# Altium project VCTS_mainboard.PrjPcb (part 2 of 2)

## Sheet Panel_Interface.SchDoc
size B; SheetNumber: 6; SheetTotal: 16
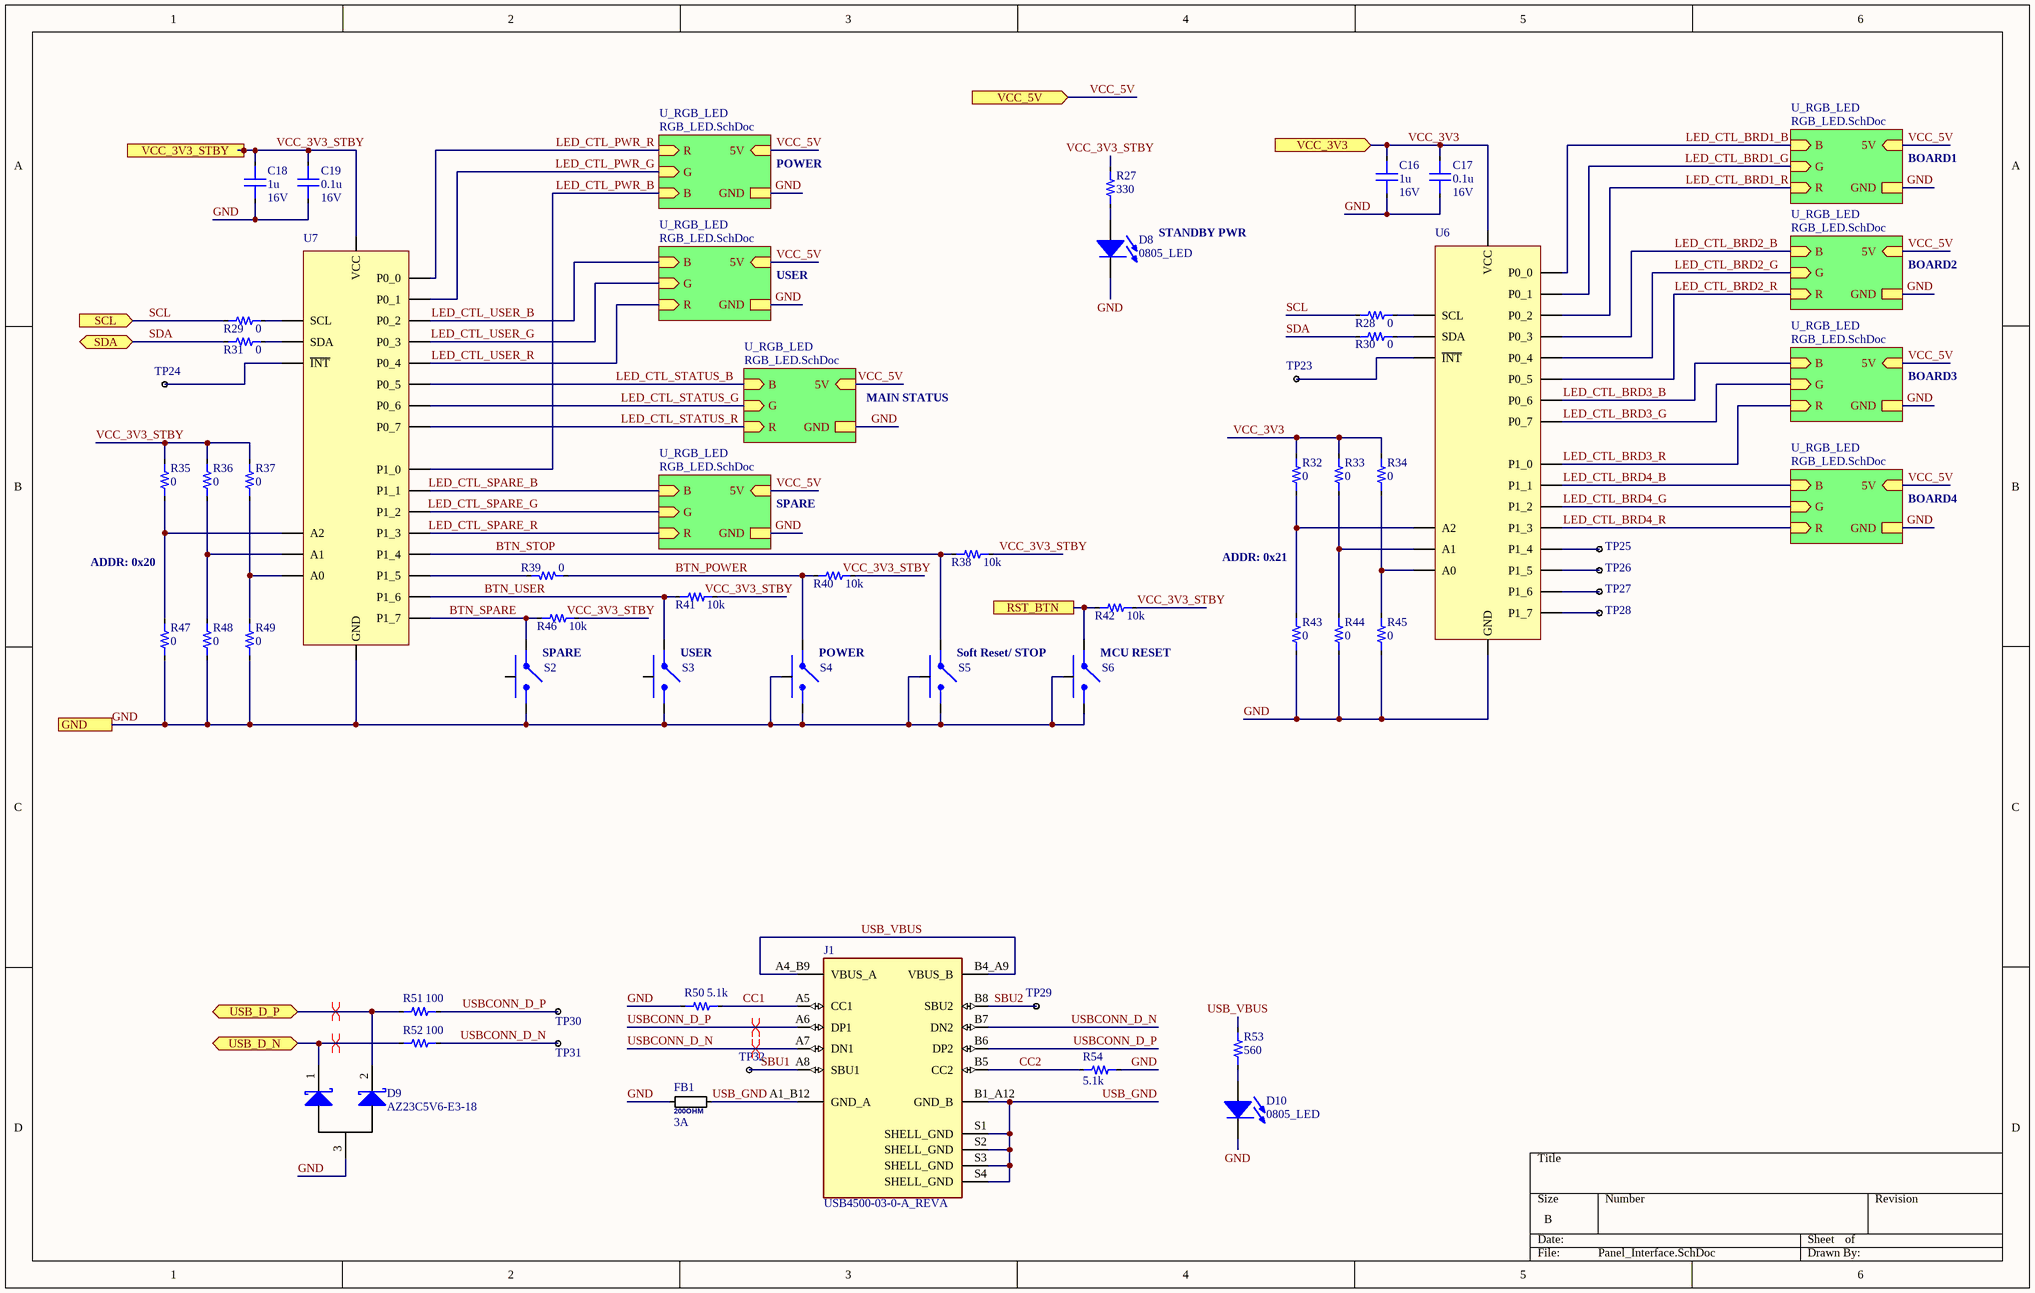
[diagram p9: Panel_Interface.SchDoc]

### Parts
C16  value 1u  Voltage: 16V  [0603_CAP]  (hidden comment: Capacitor)
C17  value 0.1u  Voltage: 16V  [0603_CAP]  (hidden comment: Capacitor)
C18  value 1u  Voltage: 16V  [0603_CAP]  (hidden comment: Capacitor)
C19  value 0.1u  Voltage: 16V  [0603_CAP]  (hidden comment: Capacitor)
D8  0805_LED  [0805_LED]
D9  AZ23C5V6-E3-18  [SOT23-3]
D10  0805_LED  [0805_LED]
FB1  =Z@100MHz: 200OHM  iMax: 3A  [0805_Ferrite]  (hidden comment: *)
J1  USB4500-03-0-A_REVA  [GCT_USB4500-03-0-A_REVA]
R27  value 330  [0603_RES]  (hidden comment: Resistor)
R28  value 0  [0603_RES]  (hidden comment: Resistor)
R29  value 0  [0603_RES]  (hidden comment: Resistor)
R30  value 0  [0603_RES]  (hidden comment: Resistor)
R31  value 0  [0603_RES]  (hidden comment: Resistor)
R32  value 0  [0603_RES]  (hidden comment: Resistor)
R33  value 0  [0603_RES]  (hidden comment: Resistor)
R34  value 0  [0603_RES]  (hidden comment: Resistor)
R35  value 0  [0603_RES]  (hidden comment: Resistor)
R36  value 0  [0603_RES]  (hidden comment: Resistor)
R37  value 0  [0603_RES]  (hidden comment: Resistor)
R38  value 10k  [0603_RES]  (hidden comment: Resistor)
R39  value 0  [0603_RES]  (hidden comment: Resistor)
R40  value 10k  [0603_RES]  (hidden comment: Resistor)
R41  value 10k  [0603_RES]  (hidden comment: Resistor)
R42  value 10k  [0603_RES]  (hidden comment: Resistor)
R43  value 0  [0603_RES]  (hidden comment: Resistor)
R44  value 0  [0603_RES]  (hidden comment: Resistor)
R45  value 0  [0603_RES]  (hidden comment: Resistor)
R46  value 10k  [0603_RES]  (hidden comment: Resistor)
R47  value 0  [0603_RES]  (hidden comment: Resistor)
R48  value 0  [0603_RES]  (hidden comment: Resistor)
R49  value 0  [0603_RES]  (hidden comment: Resistor)
R50  value 5.1k  [0603_RES]  (hidden comment: Resistor)
R51  value 100  [0603_RES]  (hidden comment: Resistor)
R52  value 100  [0603_RES]  (hidden comment: Resistor)
R53  value 560  [0603_RES]  (hidden comment: Resistor)
R54  value 5.1k  [0603_RES]  (hidden comment: Resistor)
S2  PTS645V  [PTS645V]  (value not drawn)
S3  PTS645V  [PTS645V]  (value not drawn)
S4  PTS645V  [PTS645V]  (value not drawn)
S5  PTS645V  [PTS645V]  (value not drawn)
S6  PTS645V  [PTS645V]  (value not drawn)
TP23  1mm Testpoint  [1mm_testpoint]  (value not drawn)
TP24  1mm Testpoint  [1mm_testpoint]  (value not drawn)
TP25  1mm Testpoint  [1mm_testpoint]  (value not drawn)
TP26  1mm Testpoint  [1mm_testpoint]  (value not drawn)
TP27  1mm Testpoint  [1mm_testpoint]  (value not drawn)
TP28  1mm Testpoint  [1mm_testpoint]  (value not drawn)
TP29  1mm Testpoint  [1mm_testpoint]  (value not drawn)
TP30  1mm Testpoint  [1mm_testpoint]  (value not drawn)
TP31  1mm Testpoint  [1mm_testpoint]  (value not drawn)
TP32  1mm Testpoint  [1mm_testpoint]  (value not drawn)
U6  NCA9535-Q100  [TSSOP-24. 4.4mm width]  (value not drawn)
U7  NCA9535-Q100  [TSSOP-24. 4.4mm width]  (value not drawn)

### Sub-sheets
U_RGB_LED = RGB_LED.SchDoc: 5V (in), B (in), G (in), R (in), GND
U_RGB_LED = RGB_LED.SchDoc: 5V (in), B (in), G (in), R (in), GND
U_RGB_LED = RGB_LED.SchDoc: 5V (in), B (in), G (in), R (in), GND
U_RGB_LED = RGB_LED.SchDoc: 5V (in), B (in), G (in), R (in), GND
U_RGB_LED = RGB_LED.SchDoc: 5V (in), B (in), G (in), R (in), GND
U_RGB_LED = RGB_LED.SchDoc: 5V (in), B (in), G (in), R (in), GND
U_RGB_LED = RGB_LED.SchDoc: 5V (in), B (in), G (in), R (in), GND
U_RGB_LED = RGB_LED.SchDoc: 5V (in), B (in), G (in), R (in), GND

### Ports
GND, RST_BTN, SCL (in), SDA (bidir), USB_D_N (bidir), USB_D_P (bidir), VCC_3V3 (in), VCC_3V3_STBY (in), VCC_5V (in)

### Nets
GND: C16.1 C17.1 C18.1 C19.1 D8.2(K) D9.3 D10.2(K) FB1.1 R43.1 R44.1 R45.1 R47.1 R48.1 R49.1 R50.1 R54.2 S2.2 S3.2 S4.2 S4.TAB S5.2 S5.TAB S6.2 S6.TAB U6.12(GND) U7.12(GND) ; port GND, sheet U_RGB_LED/GND, sheet U_RGB_LED/GND, sheet U_RGB_LED/GND, sheet U_RGB_LED/GND, sheet U_RGB_LED/GND, sheet U_RGB_LED/GND, sheet U_RGB_LED/GND, sheet U_RGB_LED/GND  [project net DGND]
VCC_3V3: C16.2 C17.2 R32.2 R33.2 R34.2 U6.24(VCC) ; port VCC_3V3  [project net 3V3_PWR]
VCC_3V3_STBY: C18.2 C19.2 R27.2 R35.2 R36.2 R37.2 R38.2 R40.2 R41.2 R42.2 R46.2 U7.24(VCC) ; port VCC_3V3_STBY  [project net VCC]
VCC_5V: port VCC_5V, sheet U_RGB_LED/5V, sheet U_RGB_LED/5V, sheet U_RGB_LED/5V, sheet U_RGB_LED/5V, sheet U_RGB_LED/5V, sheet U_RGB_LED/5V, sheet U_RGB_LED/5V, sheet U_RGB_LED/5V
BTN_POWER: R39.1 R40.1 S4.1
BTN_SPARE: R46.1 S2.1 U7.20(P1_7)
BTN_STOP: R38.1 S5.1 U7.17(P1_4)
BTN_USER: R41.1 S3.1 U7.19(P1_6)
CC1: J1.A5(CC1) R50.2
CC2: J1.B5(CC2) R54.1
LED_CTL_BRD1_B: U6.4(P0_0) ; sheet U_RGB_LED/B
LED_CTL_BRD1_G: U6.5(P0_1) ; sheet U_RGB_LED/G
LED_CTL_BRD1_R: U6.6(P0_2) ; sheet U_RGB_LED/R
LED_CTL_BRD2_B: U6.7(P0_3) ; sheet U_RGB_LED/B
LED_CTL_BRD2_G: U6.8(P0_4) ; sheet U_RGB_LED/G
LED_CTL_BRD2_R: U6.9(P0_5) ; sheet U_RGB_LED/R
LED_CTL_BRD3_B: U6.10(P0_6) ; sheet U_RGB_LED/B
LED_CTL_BRD3_G: U6.11(P0_7) ; sheet U_RGB_LED/G
LED_CTL_BRD3_R: U6.13(P1_0) ; sheet U_RGB_LED/R
LED_CTL_BRD4_B: U6.14(P1_1) ; sheet U_RGB_LED/B
LED_CTL_BRD4_G: U6.15(P1_2) ; sheet U_RGB_LED/G
LED_CTL_BRD4_R: U6.16(P1_3) ; sheet U_RGB_LED/R
LED_CTL_PWR_B: U7.13(P1_0) ; sheet U_RGB_LED/B
LED_CTL_PWR_G: U7.5(P0_1) ; sheet U_RGB_LED/G
LED_CTL_PWR_R: U7.4(P0_0) ; sheet U_RGB_LED/R
LED_CTL_SPARE_B: U7.14(P1_1) ; sheet U_RGB_LED/B
LED_CTL_SPARE_G: U7.15(P1_2) ; sheet U_RGB_LED/G
LED_CTL_SPARE_R: U7.16(P1_3) ; sheet U_RGB_LED/R
LED_CTL_STATUS_B: U7.9(P0_5) ; sheet U_RGB_LED/B
LED_CTL_STATUS_G: U7.10(P0_6) ; sheet U_RGB_LED/G
LED_CTL_STATUS_R: U7.11(P0_7) ; sheet U_RGB_LED/R
LED_CTL_USER_B: U7.6(P0_2) ; sheet U_RGB_LED/B
LED_CTL_USER_G: U7.7(P0_3) ; sheet U_RGB_LED/G
LED_CTL_USER_R: U7.8(P0_4) ; sheet U_RGB_LED/R
~{RST}: R42.1 S6.1 ; port RST_BTN
SBU1: J1.A8(SBU1) TP32.1
SBU2: J1.B8(SBU2) TP29.1
SCL: R28.1 R29.1 ; port SCL  [project net ONBOARD_I2C_SCL]
SDA: R30.1 R31.1 ; port SDA  [project net ONBOARD_I2C_SDA]
USB_D_N: D9.1 R52.1 ; port USB_D_N
USB_D_P: D9.2 R51.1 ; port USB_D_P
USB_GND: FB1.2 J1.A1_B12(GND_A) J1.B1_A12(GND_B) J1.S1(SHELL_GND) J1.S2(SHELL_GND) J1.S3(SHELL_GND) J1.S4(SHELL_GND)
USB_VBUS: J1.A4_B9(VBUS_A) J1.B4_A9(VBUS_B) R53.2
USBCONN_D_N: J1.A7(DN1) J1.B7(DN2) R52.2 TP31.1
USBCONN_D_P: J1.A6(DP1) J1.B6(DP2) R51.2 TP30.1
NetD8_1: D8.1(A) R27.1
NetD10_1: D10.1(A) R53.1
NetR28_2: R28.2 U6.22(SCL)
NetR29_2: R29.2 U7.22(SCL)
NetR30_2: R30.2 U6.23(SDA)
NetR31_2: R31.2 U7.23(SDA)
NetR32_1: R32.1 R43.2 U6.3(A2)
NetR33_1: R33.1 R44.2 U6.2(A1)
NetR34_1: R34.1 R45.2 U6.21(A0)
NetR35_1: R35.1 R47.2 U7.3(A2)
NetR36_1: R36.1 R48.2 U7.2(A1)
NetR37_1: R37.1 R49.2 U7.21(A0)
NetR39_2: R39.2 U7.18(P1_5)
NetTP23_1: TP23.1 U6.1(~{INT})
NetTP24_1: TP24.1 U7.1(~{INT})
NetTP25_1: TP25.1 U6.17(P1_4)
NetTP26_1: TP26.1 U6.18(P1_5)
NetTP27_1: TP27.1 U6.19(P1_6)
NetTP28_1: TP28.1 U6.20(P1_7)

Not connected (* = marked no-connect by the designer): S2 TAB; S3 TAB

### Layout directives
differential pair: USB_D_N, USB_D_P, USBCONN_D_N, USBCONN_D_P

### Notes on the sheet
- POWER
- BOARD1
- STANDBY PWR
- USER
- BOARD2
- MAIN STATUS
- BOARD3
- BOARD4
- ADDR: 0x20
- SPARE
- ADDR: 0x21
- (near S2) SPARE
- (near S3) USER
- (near S4) POWER
- Soft Reset/ STOP
- (near S6) MCU RESET

### Library data of the parts
D8 = 0805_LED: Generic 0805 LED; Color: Orange
D9 = AZ23C5V6-E3-18: Zener Diode Array 1 Pair Common Anode 5.6 V 300 mW ±7% SOT-23-3; ComponentLink1Description: Datasheet; ComponentLink1URL: https://www.vishay.com/docs/86340/az23_series.pdf; ComponentLink2Description: Digikey; ComponentLink2URL: https://www.digikey.com/en/products/detail/vishay-general-semiconductor-diodes-division/AZ23C5V6-E3-18/3104165
D10 = 0805_LED: Generic 0805 LED; Color: Green
FB1 = ChipFerrite: Link: *; MfrPartNo: *; Name: *; Resistance: *; Package: *; Inductance: *
J1 = USB4500-03-0-A_REVA: Type C USB 2.0 Connector; MF: Global Connector Technology; MP: USB4500-03-0-A; SnapEDA_Link: https://www.snapeda.com/parts/USB4500-03-0-A/Global%20Connector%20Technology/view-part/6577171/?ref=snap; Availability: No availability data; Check_prices: https://www.snapeda.com/parts/USB4500-03-0-A/Global%20Connector%20Technology/view-part/6577171/?ref=eda; Package: None; Price: None; Value: *
S2-S6 = PTS645V: Tactile Switch SPST-NO Side Actuated Surface Mount, Right Angle; Current: 0.05A; MaxVoltage: 12V; Pole: 1; Name: PTS645V; Mounting: SMD; ComponentLink1Description: Digikey; ComponentLink1URL: https://www.digikey.com/en/products/detail/c-k/PTS645SH95-2-LFS/1146763
TP23-TP32 = 1mm Testpoint: 1mm test point; ComponentLink1Description: Digikey; ComponentLink1URL: https://www.digikey.com/product-detail/en/te-connectivity-amp-connectors/RCU-0C/A106145CT-ND/3477802
U6 U7 = NCA9535-Q100: I/O Expander 16 I2C, SMBus 400 kHz 24-TSSOP; ComponentLink1Description: Digikey; ComponentLink1URL: https://www.digikey.com/en/products/detail/nexperia-usa-inc/NCA9535PW-Q100J/19109486
C16-C19 = Capacitor: Dielectric: *; Percent Tolerance: *; ESR: *
R27-R54 = Resistor: Tolerance: *

## Sheet RGB_LED.SchDoc
size A; SheetNumber: 7; SheetTotal: 16
Used 8 times, as channels U_Panel_Interface/U_RGB_LED, U_Panel_Interface/U_RGB_LED, U_Panel_Interface/U_RGB_LED, U_Panel_Interface/U_RGB_LED, U_Panel_Interface/U_RGB_LED, U_Panel_Interface/U_RGB_LED, U_Panel_Interface/U_RGB_LED, U_Panel_Interface/U_RGB_LED. Parts and nets are listed once, with the designators drawn on the sheet.
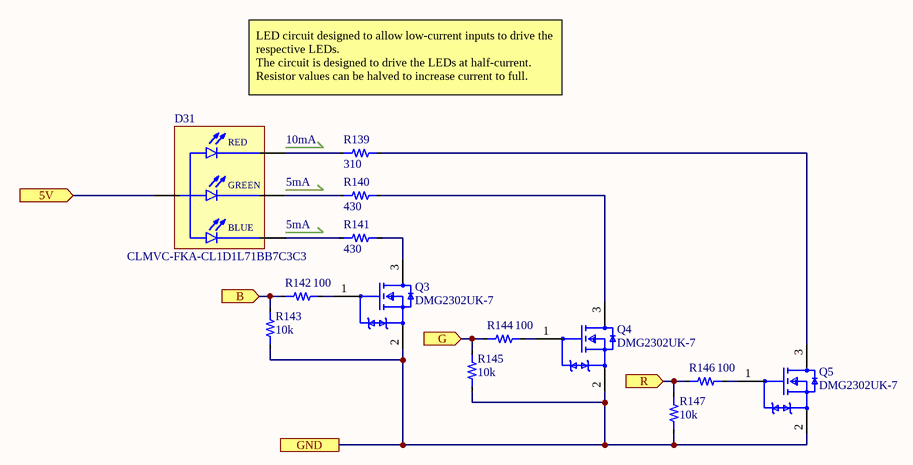
[diagram p10: RGB_LED.SchDoc]

### Parts
D31  CLMVC-FKA-CL1D1L71BB7C3C3  [4PLCC CreeLED]
Q3  DMG2302UK-7  [SOT23-3]
Q4  DMG2302UK-7  [SOT23-3]
Q5  DMG2302UK-7  [SOT23-3]
R139  value 310  [0603_RES]  (hidden comment: Resistor)
R140  value 430  [0603_RES]  (hidden comment: Resistor)
R141  value 430  [0603_RES]  (hidden comment: Resistor)
R142  value 100  [0603_RES]  (hidden comment: Resistor)
R143  value 10k  [0603_RES]  (hidden comment: Resistor)
R144  value 100  [0603_RES]  (hidden comment: Resistor)
R145  value 10k  [0603_RES]  (hidden comment: Resistor)
R146  value 100  [0603_RES]  (hidden comment: Resistor)
R147  value 10k  [0603_RES]  (hidden comment: Resistor)

### Ports
5V (in), B (in), G (in), GND, R (in)

### Nets
5V: D31.1(A) ; port 5V
B: R142.1 R143.2 ; port B
G: R144.1 R145.2 ; port G
GND: Q3.2(S) Q4.2(S) Q5.2(S) R143.1 R145.1 R147.1 ; port GND
R: R146.1 R147.2 ; port R
NetD31_2: D31.2(B_C) R141.1
NetD31_3: D31.3(G_C) R140.1
NetD31_4: D31.4(R_C) R139.1
NetQ3_1: Q3.1(G) R142.2
NetQ3_3: Q3.3(D) R141.2
NetQ4_1: Q4.1(G) R144.2
NetQ4_3: Q4.3(D) R140.2
NetQ5_1: Q5.1(G) R146.2
NetQ5_3: Q5.3(D) R139.2

### Channels
U_Panel_Interface/U_RGB_LED: designators end in _U_Panel_Interface_U_RGB_LED#1; ports 5V=VCC_5V B=LED_CTL_BRD4_B G=LED_CTL_BRD4_G GND=DGND R=LED_CTL_BRD4_R
U_Panel_Interface/U_RGB_LED: designators end in _U_Panel_Interface_U_RGB_LED#2; ports 5V=VCC_5V B=LED_CTL_BRD3_B G=LED_CTL_BRD3_G GND=DGND R=LED_CTL_BRD3_R
U_Panel_Interface/U_RGB_LED: designators end in _U_Panel_Interface_U_RGB_LED#3; ports 5V=VCC_5V B=LED_CTL_BRD2_B G=LED_CTL_BRD2_G GND=DGND R=LED_CTL_BRD2_R
U_Panel_Interface/U_RGB_LED: designators end in _U_Panel_Interface_U_RGB_LED#4; ports 5V=VCC_5V B=LED_CTL_BRD1_B G=LED_CTL_BRD1_G GND=DGND R=LED_CTL_BRD1_R
U_Panel_Interface/U_RGB_LED: designators end in _U_Panel_Interface_U_RGB_LED#5; ports 5V=VCC_5V B=LED_CTL_PWR_B G=LED_CTL_PWR_G GND=DGND R=LED_CTL_PWR_R
U_Panel_Interface/U_RGB_LED: designators end in _U_Panel_Interface_U_RGB_LED#6; ports 5V=VCC_5V B=LED_CTL_STATUS_B G=LED_CTL_STATUS_G GND=DGND R=LED_CTL_STATUS_R
U_Panel_Interface/U_RGB_LED: designators end in _U_Panel_Interface_U_RGB_LED#7; ports 5V=VCC_5V B=LED_CTL_USER_B G=LED_CTL_USER_G GND=DGND R=LED_CTL_USER_R
U_Panel_Interface/U_RGB_LED: designators end in _U_Panel_Interface_U_RGB_LED#8; ports 5V=VCC_5V B=LED_CTL_SPARE_B G=LED_CTL_SPARE_G GND=DGND R=LED_CTL_SPARE_R

### Notes on the sheet
- LED circuit designed to allow low-current inputs to drive the respective LEDs.
  The circuit is designed to drive the LEDs at half-current.
  Resistor values can be halved to increase current to full.
- 10mA
- 5mA
- (in symbol CLMVC-FKA-CL1D1L71BB7C3C3) RED; GREEN; BLUE

### Library data of the parts
D31 = CLMVC-FKA-CL1D1L71BB7C3C3: Red, Green, Blue (RGB) 622nm Red, 530nm Green, 470nm Blue LED Indication - Discrete 2V Red, 3V Green, 3V Blue 4-SMD, J-Lead; MF: Cree Inc.; SnapEDA_Link: https://www.snapeda.com/parts/CLMVC-FKA-CL1D1L71BB7C3C3/Cree+Inc./view-part/?ref=snap; Package: SMD-4 Cree Inc.; Value: *; MP: CLMVC-FKA-CL1D1L71BB7C3C3; Check_prices: https://www.snapeda.com/parts/CLMVC-FKA-CL1D1L71BB7C3C3/Cree+Inc./view-part/?ref=eda
Q3-Q5 = DMG2302UK-7: MOSFET N-CH 20V 2.8A SOT23; Manufacturer: Diodes Inc.; Reverse Recovery Time: 5.3ns; Gate Charge At Vgs: 2.8nC @ 10V; Turn On Delay Time: 0.6ns; Pulse Drain Current: 12A; Max Forward Diode Voltage: 1.2V; Reverse Recovery Charge: 0.5nC; Automotive Grade: Grade 0; Threshold Vgs Min: 0.3V; Number Of N Channels: 1; Standoff Height: 0.013mm; Typ Forward Diode Voltage: 0.7V; Drain To Source Resistance: 61mΩ; Rthja Max: 192°C/W; Max Junction Temp: +150°C; Input Capacitace At Vds: 130pF @ 10V; Threshold Vgs Max: 1V; Turn Off Delay Time: 4.2ns; Depletion Mode: False; Gate To Source Voltage: 12V; Power Dissipation: 0.66W; Device Class L1: Discrete Semiconductors; Footprint Url: https://www.diodes.com/assets/Package-Files/SOT23.pdf; Lead Free: Yes; Manufacturer Part Number: DMG2302UK-7; Temperature Range High: +150°C; Drain To Source Voltage: 20V; Category: Trans; Digikey Description: MOSFET N-CH 20V 2.8A SOT23; RoHS: TRUE; Device Class L2: Transistors; Height: 1.1mm; Automotive: Yes; Package: SOT23; Drain To Source Breakdown Voltage: 20V; Continuous Drain Current: 2.8A; ComponentLink2Description: Datasheet; Device Class L3: MOSFETs; Octopart: https://octopart.com/dmg2302uk-7-diodes+inc.-73850182; Temperature Range Low: -55°C; Temperature: -55°C to +150°C; Number Of Channels: 1; ComponentLink2URL: https://www.diodes.com/assets/Datasheets/DMG2302UK.pdf
R139-R147 = Resistor: Tolerance: *

## Sheet FAN_Conn.SchDoc
size A; SheetNumber: 8; SheetTotal: 16
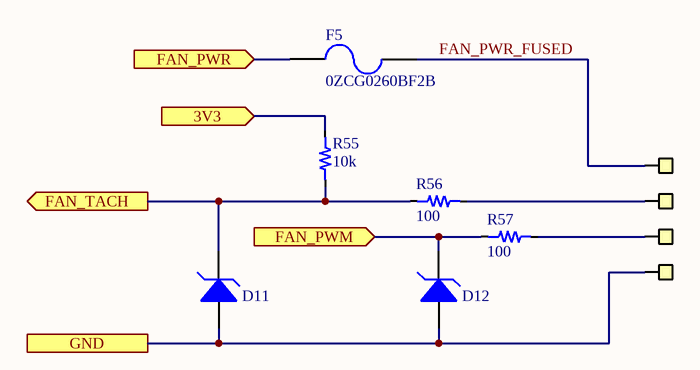
[diagram p11: FAN_Conn.SchDoc]

### Parts
D11  SZMMSZ5227BT1G  [SOD-123]  (value not drawn)
D12  SZMMSZ5227BT1G  [SOD-123]  (value not drawn)
F5  0ZCG0260BF2B  [1812_PTC_FUSE]
R55  value 10k  [0603_RES]  (hidden comment: Resistor)
R56  value 100  [0603_RES]  (hidden comment: Resistor)
R57  value 100  [0603_RES]  (hidden comment: Resistor)
X6  GenericPinHeader(0.1in)  [GenericPinHeader(.1in)]  (value not drawn)
X7  GenericPinHeader(0.1in)  [GenericPinHeader(.1in)]  (value not drawn)
X8  GenericPinHeader(0.1in)  [GenericPinHeader(.1in)]  (value not drawn)
X9  GenericPinHeader(0.1in)  [GenericPinHeader(.1in)]  (value not drawn)

### Ports
3V3 (in), FAN_PWM (in), FAN_PWR (in), FAN_TACH (out), GND

### Nets
3V3_PWR: R55.2 ; port 3V3
12V_PWR: F5.1 ; port FAN_PWR
DGND: D11.2(A) D12.2(A) X9.1(Pin) ; port GND
FAN_PWM: D12.1(K) R57.2 ; port FAN_PWM
FAN_PWR_FUSED: F5.2 X6.1(Pin)
FAN_TACH: D11.1(K) R55.1 R56.2 ; port FAN_TACH
NetR56_1: R56.1 X7.1(Pin)
NetR57_1: R57.1 X8.1(Pin)

### Library data of the parts
D11 D12 = SZMMSZ5227BT1G: Zener Diode 3.6 V 500 mW ±5% Surface Mount SOD-123; Vr: 3.6; Num_Circuits: 1; Package: SOD-123; ComponentLink1Description: Digikey; ComponentLink1URL: https://www.digikey.com/en/products/detail/onsemi/SZMMSZ5227BT1G/3063346
F5 = PTC Fuse: Generic PTC fuse footprints. Add; Current - Hold (Ih): 2.6A; Current - Trip (It): 5A; Voltage - Max: *; Resistance - Initial (Ri) (Min): *; Resistance - Post Trip (R1) (Max): *
X6-X9 = GenericPinHeader(0.1in): Generic .1in(2.54mm) pitch pin header
R55-R57 = Resistor: Tolerance: *

## Sheet Interface_Load_Switching.SchDoc
size B; SheetNumber: 14; SheetTotal: 16
Used 2 times, as channels U_Interface_Load_Switching, U_Interface_Load_Switching. Parts and nets are listed once, with the designators drawn on the sheet.
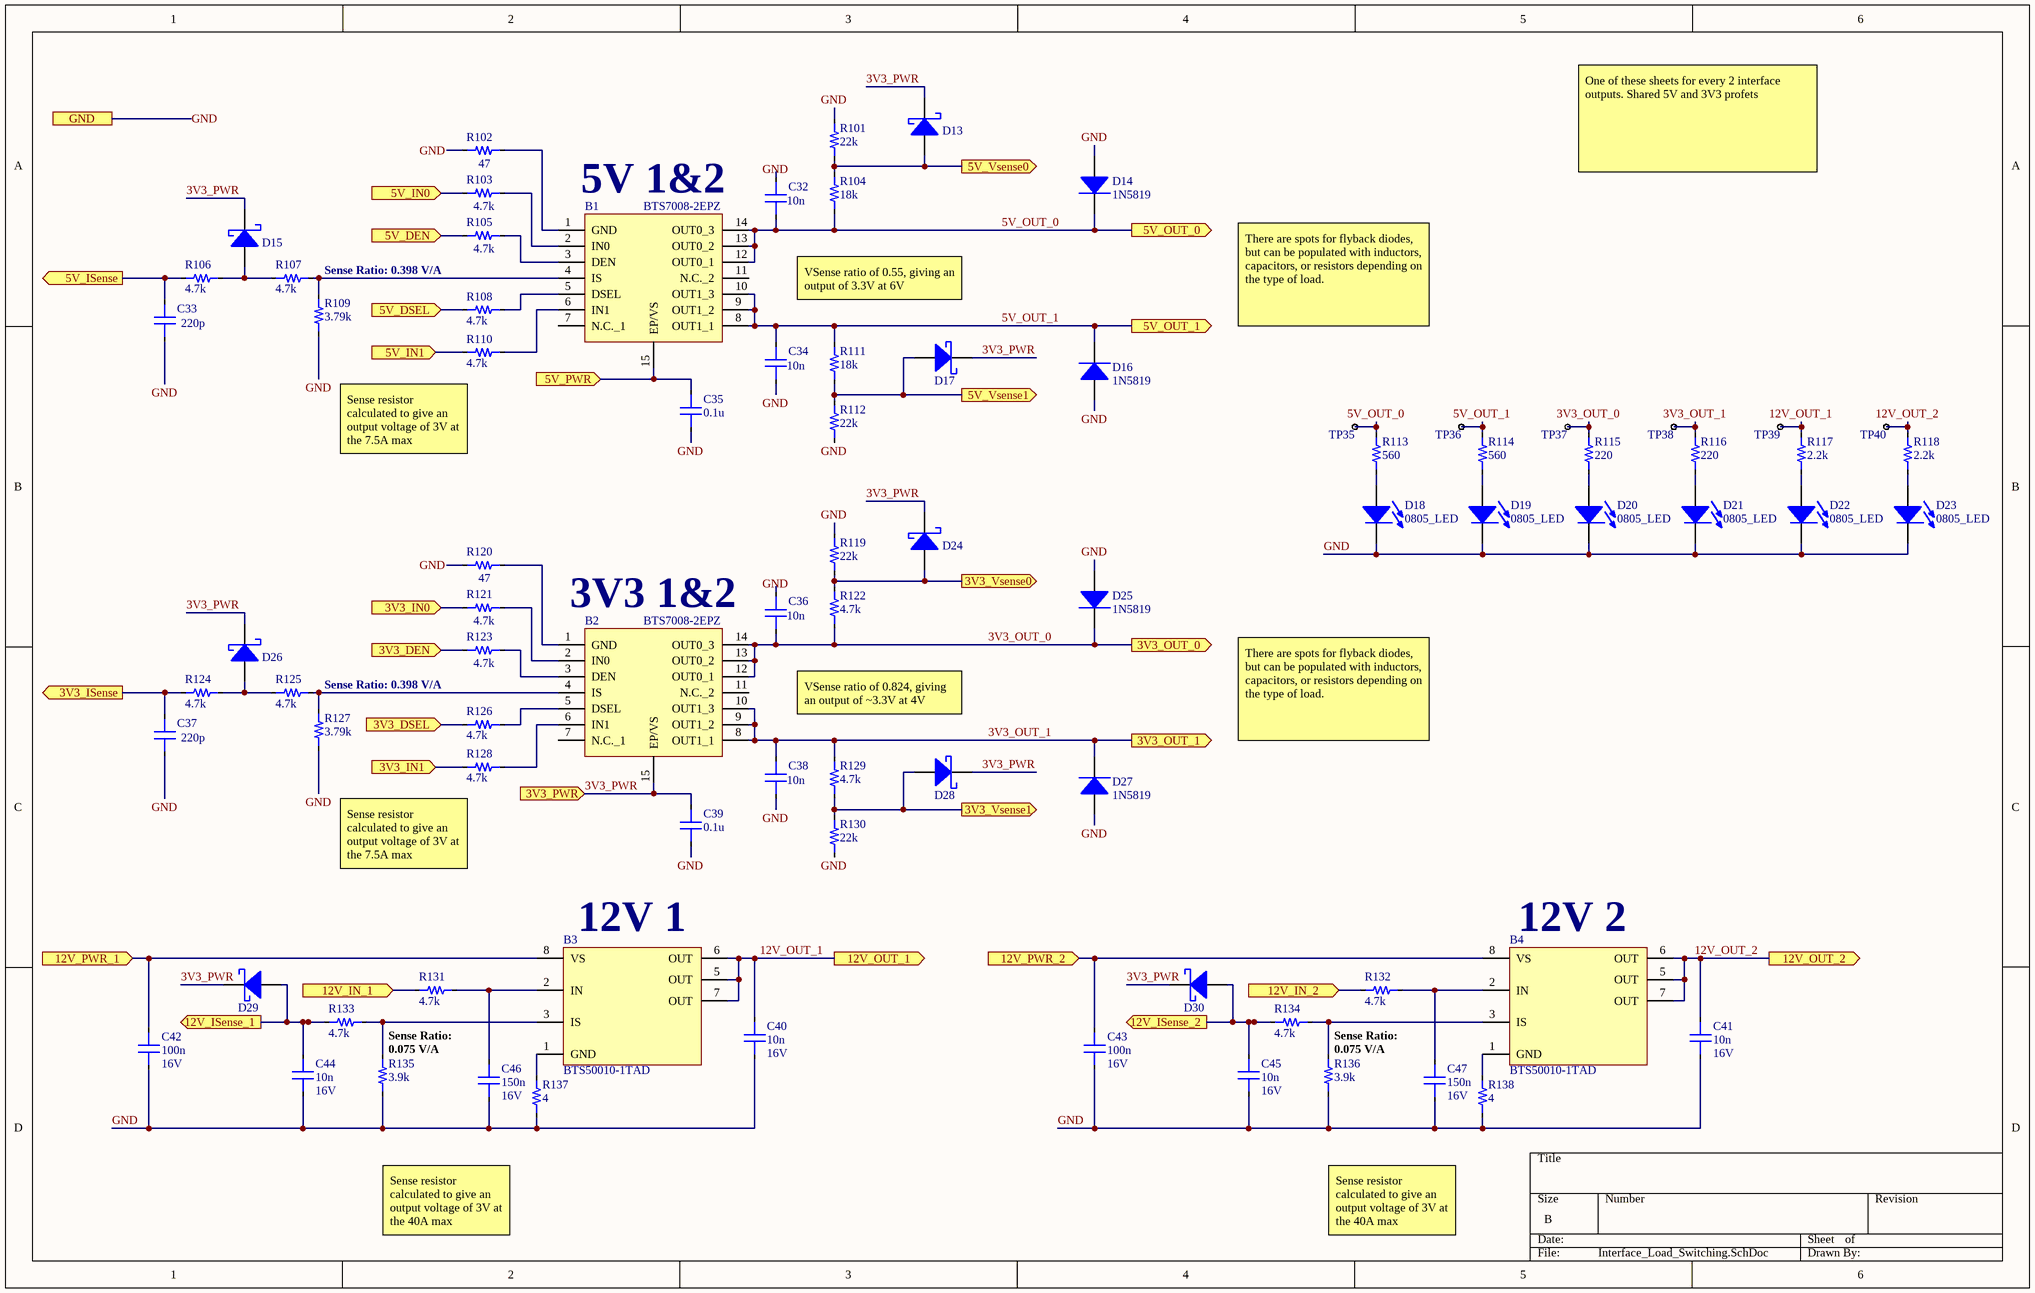
[diagram p12: Interface_Load_Switching.SchDoc]

### Parts
B1  BTS7008-2EPZ  [SOP65P600X115-15N]
B2  BTS7008-2EPZ  [SOP65P600X115-15N]
B3  BTS50010-1TAD  [TO-263-7]
B4  BTS50010-1TAD  [TO-263-7]
C32  value 10n  [0603_CAP]  (hidden comment: Capacitor)
C33  value 220p  [0603_CAP]  (hidden comment: Capacitor)
C34  value 10n  [0603_CAP]  (hidden comment: Capacitor)
C35  value 0.1u  [0603_CAP]  (hidden comment: Capacitor)
C36  value 10n  [0603_CAP]  (hidden comment: Capacitor)
C37  value 220p  [0603_CAP]  (hidden comment: Capacitor)
C38  value 10n  [0603_CAP]  (hidden comment: Capacitor)
C39  value 0.1u  [0603_CAP]  (hidden comment: Capacitor)
C40  value 10n  Voltage: 16V  [0603_CAP]  (hidden comment: Capacitor)
C41  value 10n  Voltage: 16V  [0603_CAP]  (hidden comment: Capacitor)
C42  value 100n  Voltage: 16V  [0603_CAP]  (hidden comment: Capacitor)
C43  value 100n  Voltage: 16V  [0603_CAP]  (hidden comment: Capacitor)
C44  value 10n  Voltage: 16V  [0603_CAP]  (hidden comment: Capacitor)
C45  value 10n  Voltage: 16V  [0603_CAP]  (hidden comment: Capacitor)
C46  value 150n  Voltage: 16V  [0603_CAP]  (hidden comment: Capacitor)
C47  value 150n  Voltage: 16V  [0603_CAP]  (hidden comment: Capacitor)
D13  RBR2MM30BTFTR  [SOD-123F]  (value not drawn)
D14  1N5819  [SOD-123F]
D15  RBR2MM30BTFTR  [SOD-123F]  (value not drawn)
D16  1N5819  [SOD-123F]
D17  RBR2MM30BTFTR  [SOD-123F]  (value not drawn)
D18  0805_LED  [0805_LED]
D19  0805_LED  [0805_LED]
D20  0805_LED  [0805_LED]
D21  0805_LED  [0805_LED]
D22  0805_LED  [0805_LED]
D23  0805_LED  [0805_LED]
D24  RBR2MM30BTFTR  [SOD-123F]  (value not drawn)
D25  1N5819  [SOD-123F]
D26  RBR2MM30BTFTR  [SOD-123F]  (value not drawn)
D27  1N5819  [SOD-123F]
D28  RBR2MM30BTFTR  [SOD-123F]  (value not drawn)
D29  RBR2MM30BTFTR  [SOD-123F]  (value not drawn)
D30  RBR2MM30BTFTR  [SOD-123F]  (value not drawn)
R101  value 22k  [0603_RES]  (hidden comment: Resistor)
R102  value 47  [0603_RES]  (hidden comment: Resistor)
R103  value 4.7k  [0603_RES]  (hidden comment: R(IN))
R104  value 18k  [0603_RES]  (hidden comment: Resistor)
R105  value 4.7k  [0603_RES]  (hidden comment: Resistor)
R106  value 4.7k  [0603_RES]  (hidden comment: Resistor)
R107  value 4.7k  [0603_RES]  (hidden comment: Resistor)
R108  value 4.7k  [0603_RES]  (hidden comment: Resistor)
R109  value 3.79k  [0603_RES]  (hidden comment: Resistor)
R110  value 4.7k  [0603_RES]  (hidden comment: Resistor)
R111  value 18k  [0603_RES]  (hidden comment: Resistor)
R112  value 22k  [0603_RES]  (hidden comment: Resistor)
R113  value 560  [0603_RES]  (hidden comment: Resistor)
R114  value 560  [0603_RES]  (hidden comment: Resistor)
R115  value 220  [0603_RES]  (hidden comment: Resistor)
R116  value 220  [0603_RES]  (hidden comment: Resistor)
R117  value 2.2k  [0603_RES]  (hidden comment: Resistor)
R118  value 2.2k  [0603_RES]  (hidden comment: Resistor)
R119  value 22k  [0603_RES]  (hidden comment: Resistor)
R120  value 47  [0603_RES]  (hidden comment: Resistor)
R121  value 4.7k  [0603_RES]  (hidden comment: R(IN))
R122  value 4.7k  [0603_RES]  (hidden comment: Resistor)
R123  value 4.7k  [0603_RES]  (hidden comment: Resistor)
R124  value 4.7k  [0603_RES]  (hidden comment: Resistor)
R125  value 4.7k  [0603_RES]  (hidden comment: Resistor)
R126  value 4.7k  [0603_RES]  (hidden comment: Resistor)
R127  value 3.79k  [0603_RES]  (hidden comment: Resistor)
R128  value 4.7k  [0603_RES]  (hidden comment: Resistor)
R129  value 4.7k  [0603_RES]  (hidden comment: Resistor)
R130  value 22k  [0603_RES]  (hidden comment: Resistor)
R131  value 4.7k  [0603_RES]  (hidden comment: Resistor)
R132  value 4.7k  [0603_RES]  (hidden comment: Resistor)
R133  value 4.7k  [0603_RES]  (hidden comment: Resistor)
R134  value 4.7k  [0603_RES]  (hidden comment: Resistor)
R135  value 3.9k  [0603_RES]  (hidden comment: Resistor)
R136  value 3.9k  [0603_RES]  (hidden comment: Resistor)
R137  value 4  [0805_RES]  (hidden comment: Resistor)
R138  value 4  [0805_RES]  (hidden comment: Resistor)
TP35  1mm Testpoint  [1mm_testpoint]  (value not drawn)
TP36  1mm Testpoint  [1mm_testpoint]  (value not drawn)
TP37  1mm Testpoint  [1mm_testpoint]  (value not drawn)
TP38  1mm Testpoint  [1mm_testpoint]  (value not drawn)
TP39  1mm Testpoint  [1mm_testpoint]  (value not drawn)
TP40  1mm Testpoint  [1mm_testpoint]  (value not drawn)

### Ports
3V3_DEN (in), 3V3_DSEL (in), 3V3_IN0 (in), 3V3_IN1 (in), 3V3_ISense (out), 3V3_OUT_0 (out), 3V3_OUT_1 (out), 3V3_PWR (in), 3V3_Vsense0 (out), 3V3_Vsense1 (out), 5V_DEN (in), 5V_DSEL (in), 5V_IN0 (in), 5V_IN1 (in), 5V_ISense (out), 5V_OUT_0 (out), 5V_OUT_1 (out), 5V_PWR (in), 5V_Vsense0 (out), 5V_Vsense1 (out), 12V_IN_1 (in), 12V_IN_2 (in), 12V_ISense_1 (out), 12V_ISense_2 (out), 12V_OUT_1 (out), 12V_OUT_2 (out), 12V_PWR_1 (in), 12V_PWR_2 (in), GND

### Nets
3V3_DEN: R123.2 ; port 3V3_DEN
3V3_DSEL: R126.1 ; port 3V3_DSEL
3V3_IN0: R121.2 ; port 3V3_IN0
3V3_IN1: R128.2 ; port 3V3_IN1
3V3_ISense: C37.2 R124.1 ; port 3V3_ISense
3V3_OUT_0: B2.12(OUT0_1) B2.13(OUT0_2) B2.14(OUT0_3) C36.1 D25.1 R115.2 R122.1 TP37.1 ; port 3V3_OUT_0
3V3_OUT_1: B2.8(OUT1_1) B2.9(OUT1_2) B2.10(OUT1_3) C38.2 D27.1 R116.2 R129.1 TP38.1 ; port 3V3_OUT_1
3V3_PWR: B2.15(EP/VS) C39.2 D13.1(K) D15.1(K) D17.1(K) D24.1(K) D26.1(K) D28.1(K) D29.1(K) D30.1(K) ; port 3V3_PWR
3V3_Vsense0: D24.2(A) R119.1 R122.2 ; port 3V3_Vsense0
3V3_Vsense1: D28.2(A) R129.2 R130.1 ; port 3V3_Vsense1
5V_DEN: R105.2 ; port 5V_DEN
5V_DSEL: R108.1 ; port 5V_DSEL
5V_IN0: R103.2 ; port 5V_IN0
5V_IN1: R110.2 ; port 5V_IN1
5V_ISense: C33.2 R106.1 ; port 5V_ISense
5V_OUT_0: B1.12(OUT0_1) B1.13(OUT0_2) B1.14(OUT0_3) C32.1 D14.1 R104.1 R113.2 TP35.1 ; port 5V_OUT_0
5V_OUT_1: B1.8(OUT1_1) B1.9(OUT1_2) B1.10(OUT1_3) C34.2 D16.1 R111.1 R114.2 TP36.1 ; port 5V_OUT_1
5V_PWR: B1.15(EP/VS) C35.2 ; port 5V_PWR
5V_Vsense0: D13.2(A) R101.1 R104.2 ; port 5V_Vsense0
5V_Vsense1: D17.2(A) R111.2 R112.1 ; port 5V_Vsense1
12V_IN_1: R131.1 ; port 12V_IN_1
12V_IN_2: R132.1 ; port 12V_IN_2
12V_ISense_1: C44.2 D29.2(A) R133.1 ; port 12V_ISense_1
12V_ISense_2: C45.2 D30.2(A) R134.1 ; port 12V_ISense_2
12V_OUT_1: B3.5(OUT) B3.6(OUT) B3.7(OUT) C40.2 R117.2 TP39.1 ; port 12V_OUT_1
12V_OUT_2: B4.5(OUT) B4.6(OUT) B4.7(OUT) C41.2 R118.2 TP40.1 ; port 12V_OUT_2
12V_PWR_1: B3.8(VS) C42.2 ; port 12V_PWR_1
12V_PWR_2: B4.8(VS) C43.2 ; port 12V_PWR_2
GND: C32.2 C33.1 C34.1 C35.1 C36.2 C37.1 C38.1 C39.1 C40.1 C41.1 C42.1 C43.1 C44.1 C45.1 C46.1 C47.1 D14.2 D16.2 D18.2(K) D19.2(K) D20.2(K) D21.2(K) D22.2(K) D23.2(K) D25.2 D27.2 R101.2 R102.2 R109.1 R112.2 R119.2 R120.2 R127.1 R130.2 R135.1 R136.1 R137.1 R138.1 ; port GND
NetB1_1: B1.1(GND) R102.1
NetB1_2: B1.2(IN0) R103.1
NetB1_3: B1.3(DEN) R105.1
NetB1_4: B1.4(IS) R107.2 R109.2
NetB1_5: B1.5(DSEL) R108.2
NetB1_6: B1.6(IN1) R110.1
NetB2_1: B2.1(GND) R120.1
NetB2_2: B2.2(IN0) R121.1
NetB2_3: B2.3(DEN) R123.1
NetB2_4: B2.4(IS) R125.2 R127.2
NetB2_5: B2.5(DSEL) R126.2
NetB2_6: B2.6(IN1) R128.1
NetB3_1: B3.1(GND) R137.2
NetB3_2: B3.2(IN) C46.2 R131.2
NetB3_3: B3.3(IS) R133.2 R135.2
NetB4_1: B4.1(GND) R138.2
NetB4_2: B4.2(IN) C47.2 R132.2
NetB4_3: B4.3(IS) R134.2 R136.2
NetD15_2: D15.2(A) R106.2 R107.1
NetD18_1: D18.1(A) R113.1
NetD19_1: D19.1(A) R114.1
NetD20_1: D20.1(A) R115.1
NetD21_1: D21.1(A) R116.1
NetD22_1: D22.1(A) R117.1
NetD23_1: D23.1(A) R118.1
NetD26_2: D26.2(A) R124.2 R125.1

Not connected (* = marked no-connect by the designer): B1 7(N.C._1) 11(N.C._2); B2 7(N.C._1) 11(N.C._2)

### Channels
U_Interface_Load_Switching: designators end in _U_Interface_Load_Switching#1; ports 3V3_DEN=PWR_D_EN 3V3_DSEL=PWR_D_SEL 3V3_IN0=12V_IN_1 3V3_IN1=12V_IN_2 3V3_ISense=3V3_ISense 3V3_OUT_0=3V3_OUT_0 3V3_OUT_1=3V3_OUT_1 3V3_PWR=3V3_PWR 3V3_Vsense0=3V3_Vsense0 3V3_Vsense1=3V3_Vsense1 5V_DEN=PWR_D_EN 5V_DSEL=PWR_D_SEL 5V_IN0=12V_IN_1 5V_IN1=12V_IN_2 5V_ISense=5V_ISense 5V_OUT_0=5V_OUT_0 5V_OUT_1=5V_OUT_1 5V_PWR=VCC_5V 5V_Vsense0=5V_Vsense0 5V_Vsense1=5V_Vsense1 12V_IN_1=12V_IN_1 12V_IN_2=12V_IN_2 12V_ISense_1=12V_ISense_1 12V_ISense_2=12V_ISense_2 12V_OUT_1=12V_OUT_1 12V_OUT_2=12V_OUT_2 12V_PWR_1=12V_PWR 12V_PWR_2=12V_PWR GND=DGND
U_Interface_Load_Switching: designators end in _U_Interface_Load_Switching#2; ports 3V3_DEN=PWR_D_EN 3V3_DSEL=PWR_D_SEL 3V3_IN0=12V_IN_1 3V3_IN1=12V_IN_2 3V3_ISense=3V3_ISense 3V3_OUT_0=3V3_OUT_0 3V3_OUT_1=3V3_OUT_1 3V3_PWR=3V3_PWR 3V3_Vsense0=3V3_Vsense0 3V3_Vsense1=3V3_Vsense1 5V_DEN=PWR_D_EN 5V_DSEL=PWR_D_SEL 5V_IN0=12V_IN_1 5V_IN1=12V_IN_2 5V_ISense=5V_ISense 5V_OUT_0=5V_OUT_0 5V_OUT_1=5V_OUT_1 5V_PWR=VCC_5V 5V_Vsense0=5V_Vsense0 5V_Vsense1=5V_Vsense1 12V_IN_1=12V_IN_1 12V_IN_2=12V_IN_2 12V_ISense_1=12V_ISense_1 12V_ISense_2=12V_ISense_2 12V_OUT_1=12V_OUT_1 12V_OUT_2=12V_OUT_2 12V_PWR_1=12V_PWR 12V_PWR_2=12V_PWR GND=DGND

### Notes on the sheet
- One of these sheets for every 2 interface outputs. Shared 5V and 3V3 profets
- (near B1) 5V 1&2
- Sense Ratio: 0.398 V/A
- VSense ratio of 0.55, giving an output of 3.3V at 6V
- There are spots for flyback diodes, but can be populated with inductors, capacitors, or resistors depending on the type of load.
- (near R110) Sense resistor calculated to give an output voltage of 3V at the 7.5A max
- (near B2) 3V3 1&2
- VSense ratio of 0.824, giving an output of ~3.3V at 4V
- (near R128) Sense resistor calculated to give an output voltage of 3V at the 7.5A max
- (near B3) 12V 1
- (near B4) 12V 2
- (near R135) Sense Ratio:
  0.075 V/A
- (near R136) Sense Ratio:
  0.075 V/A
- Sense resistor calculated to give an output voltage of 3V at the 40A max

### Library data of the parts
B1 B2 = BTS7008-2EPZ: PROFET +2 12V Smart High-Side Power Switch; Manufacturer_Name: Infineon; Geometry.Height: 1.15mm; Manufacturer_Part_Number: BTS7008-2EPZ; Mouser Part Number: *; Mouser Price/Stock: *; Arrow Part Number: *; Arrow Price/Stock: *; Mouser Testing Part Number: *; Mouser Testing Price/Stock: *; Datasheet Link: https://4donline.ihs.com/images/VipMasterIC/IC/INFN/INFN-S-A0012431809/INFN-S-A0012432886-1.pdf?hkey=EF798316E3902B6ED9A73243A3159BB0; Supplier 1: Mouser; Supplier Part Number 1: 726-BTS70082EPZXUMA1
B3 B4 = BTS50010-1TAD: Power Switch/Driver 1:1 N-Channel 48A P/PG-TO-263-7-10; ComponentLink1Description: Digikey; ComponentLink1URL: https://www.digikey.com/en/products/detail/infineon-technologies/BTS500101TADATMA2/9693060; ComponentLink2Description: Datasheet; ComponentLink2URL: https://www.infineon.com/dgdl/Infineon-BTS50010-1TAD-DS-v01_01-EN.pdf?fileId=5546d462576f34750157c38810ca55cd
C32 C34 C36 C38 = Capacitor: Protection of BTS7008-2EPZ output during ESD events and BCI; Voltage: 16V; Dielectric: *; Percent Tolerance: *; ESR: *
C33 C37 = Capacitor: Sense signal filtering; Voltage: 16V; Dielectric: *; Percent Tolerance: *; ESR: *
D13 D15 D17 D24 D26 D28-D30 = RBR2MM30BTFTR: Diode Schottky 30 V 2A Surface Mount SOD-123F; Vr: 30; Num_Circuits: 1; Vf: 490 mV @ 2 A; Package: SOD-123F; ComponentLink1Description: Digikey; ComponentLink1URL: https://www.digikey.com/en/products/detail/rohm-semiconductor/RBR2MM30BTFTR/9748137
D14 D16 D25 D27 = 1N5819: Diode Super Barrier 40V 1A Surface Mount SOD-123F; Num_Circuits: 1; Vr: 40V; Package: SOD-123F; ComponentLink1Description: Digikey; ComponentLink1URL: https://www.digikey.com/product-detail/en/diodes-incorporated/1N5819HW1-7-F/1N5819HW1-7-FDITR-ND/5768523
D18-D23 = 0805_LED: Generic 0805 LED; Color: Green
R101 R104 R119 R122 R135 R136 = Resistor: Tolerance: 1%
R103 R105 R110 R121 R123 R128 = Resistor: Protection of the microcontroller during Overvoltage and Reverse Polarity / Necessary to switch OFF BTS7008-2EPZ output during Loss of Ground; Tolerance: *
R106 R124 = Resistor: Protection of microcontroller ADC input during Overvoltage, Reverse / Polarity, Loss of Ground / Value to be tuned according to microcontroller specifications; Tolerance: *
R109 R127 = Resistor: SENSE resistor; Tolerance: 1%
R111 R112 R129 R130 = Resistor: Protection of the microcontroller during Overvoltage and Reverse Polarity / Necessary to switch OFF BTS7008-2EPZ output during Loss of Ground; Tolerance: 1%
TP35-TP40 = 1mm Testpoint: 1mm test point; ComponentLink1Description: Digikey; ComponentLink1URL: https://www.digikey.com/product-detail/en/te-connectivity-amp-connectors/RCU-0C/A106145CT-ND/3477802
C35 C39-C47 = Capacitor: Dielectric: *; Percent Tolerance: *; ESR: *
R102 R107 R108 R113-R118 R120 R125 R126 R131-R134 R137 R138 = Resistor: Tolerance: *

## Sheet 3V3_LDO.SchDoc
size A; SheetNumber: 15; SheetTotal: 16
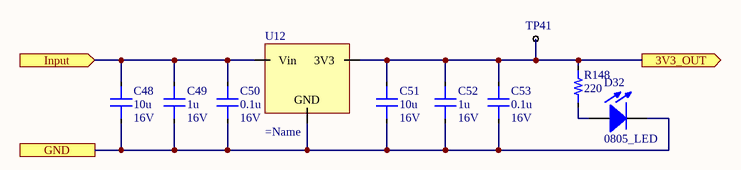
[diagram p13: 3V3_LDO.SchDoc]

### Parts
C48  value 10u  Voltage: 16V  [0805_CAP]  (hidden comment: Capacitor)
C49  value 1u  Voltage: 16V  [0603_CAP]  (hidden comment: Capacitor)
C50  value 0.1u  Voltage: 16V  [0805_CAP]  (hidden comment: Capacitor)
C51  value 10u  Voltage: 16V  [0805_CAP]  (hidden comment: Capacitor)
C52  value 1u  Voltage: 16V  [0805_CAP]  (hidden comment: Capacitor)
C53  value 0.1u  Voltage: 16V  [0805_CAP]  (hidden comment: Capacitor)
D32  0805_LED  [0805_LED]
R148  value 220  [0603_RES]  (hidden comment: Resistor)
TP41  1mm Testpoint  [1mm_testpoint]  (value not drawn)
U12  (no value)  [DPAK3_TO-252-3]

### Ports
3V3_OUT (out), GND, Input (in)

### Nets
5VSB_ATX: C48.2 C49.2 C50.2 U12.3(Vin) ; port Input
DGND: C48.1 C49.1 C50.1 C51.1 C52.1 C53.1 D32.2(K) U12.1(GND) ; port GND
VCC: C51.2 C52.2 C53.2 R148.2 TP41.1 U12.4(3V3) ; port 3V3_OUT
NetD32_1: D32.1(A) R148.1

### Library data of the parts
D32 = 0805_LED: Generic 0805 LED; Color: Green
TP41 = 1mm Testpoint: 1mm test point; ComponentLink1Description: Digikey; ComponentLink1URL: https://www.digikey.com/product-detail/en/te-connectivity-amp-connectors/RCU-0C/A106145CT-ND/3477802
U12 = NCP1117DT33T5G: IC REG LINEAR 3.3V 1A DPAK
C48-C53 = Capacitor: Dielectric: *; Percent Tolerance: *; ESR: *
R148 = Resistor: Tolerance: *

## Sheet Low_Current_Sense.SchDoc
size A; SheetNumber: 13; SheetTotal: 16
Used 2 times, as channels U_Low_Current_Sense, U_Low_Current_Sense. Parts and nets are listed once, with the designators drawn on the sheet.
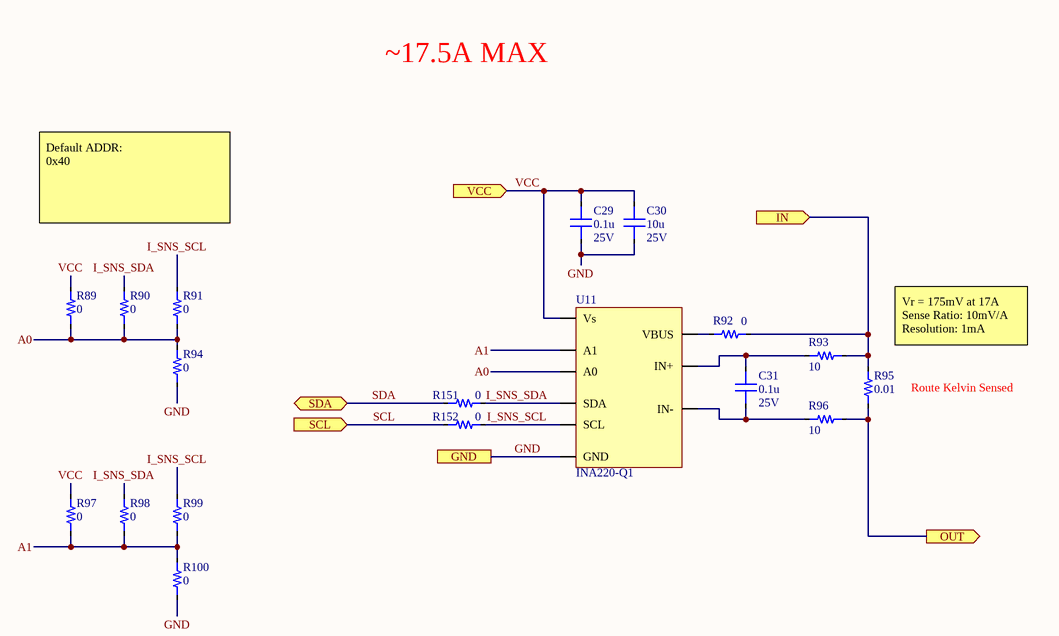
[diagram p14: Low_Current_Sense.SchDoc]

### Parts
C29  value 0.1u  Voltage: 25V  [0603_CAP]  (hidden comment: Capacitor)
C30  value 10u  Voltage: 25V  [0805_CAP]  (hidden comment: Capacitor)
C31  value 0.1u  Voltage: 25V  [0603_CAP]  (hidden comment: Capacitor)
R89  value 0  [0603_RES]  (hidden comment: Resistor)
R90  value 0  [0603_RES]  (hidden comment: Resistor)
R91  value 0  [0603_RES]  (hidden comment: Resistor)
R92  value 0  [0603_RES]  (hidden comment: Resistor)
R93  value 10  [0603_RES]  (hidden comment: Resistor)
R94  value 0  [0603_RES]  (hidden comment: Resistor)
R95  value 0.01  [2512_RES]  (hidden comment: Resistor)
R96  value 10  [0603_RES]  (hidden comment: Resistor)
R97  value 0  [0603_RES]  (hidden comment: Resistor)
R98  value 0  [0603_RES]  (hidden comment: Resistor)
R99  value 0  [0603_RES]  (hidden comment: Resistor)
R100  value 0  [0603_RES]  (hidden comment: Resistor)
R151  value 0  [0603_RES]  (hidden comment: Resistor)
R152  value 0  [0603_RES]  (hidden comment: Resistor)
U11  INA220-Q1  [TSSOP-10]

### Ports
GND, IN (in), OUT (out), SCL (in), SDA (bidir), VCC (in)

### Nets
A0: R89.1 R90.1 R91.1 R94.2 U11.2(A0)
A1: R97.1 R98.1 R99.1 R100.2 U11.1(A1)
GND: C29.1 C30.1 R94.1 R100.1 U11.7(GND) ; port GND
I_SNS_SCL: R91.2 R99.2 R152.2 U11.5(SCL)
I_SNS_SDA: R90.2 R98.2 R151.2 U11.4(SDA)
IN: R92.2 R93.2 R95.2 ; port IN
OUT: R95.1 R96.2 ; port OUT
SCL: R152.1 ; port SCL
SDA: R151.1 ; port SDA
VCC: C29.2 C30.2 R89.2 R97.2 U11.6(Vs) ; port VCC
NetC31_1: C31.1 R96.1 U11.9(IN-)
NetC31_2: C31.2 R93.1 U11.10(IN+)
NetR92_1: R92.1 U11.8(VBUS)

### Channels
U_Low_Current_Sense: designators end in _U_Low_Current_Sense#1; ports GND=DGND IN=5V_ATX OUT=VCC_5V SCL=ONBOARD_I2C_SCL SDA=ONBOARD_I2C_SDA VCC=3V3_PWR
U_Low_Current_Sense: designators end in _U_Low_Current_Sense#2; ports GND=DGND IN=3V3_ATX OUT=3V3_PWR SCL=ONBOARD_I2C_SCL SDA=ONBOARD_I2C_SDA VCC=3V3_PWR

### Notes on the sheet
- ~17.5A MAX
- Default ADDR:
  0x40
- Vr = 175mV at 17A
  Sense Ratio: 10mV/A
  Resolution: 1mA
- (near R95) Route Kelvin Sensed

### Library data of the parts
R95 = Resistor: Tolerance: 1%; Power: 3
U11 = INA220-Q1: Current Monitor Regulator High/Low-Side 10mA 10-VSSOP; Name: INA220-Q1; ComponentLink1Description: Datasheet; ComponentLink1URL: https://www.analog.com/media/en/technical-documentation/data-sheets/6100fd.pdf; ComponentLink2Description: Digikey; ComponentLink2URL: https://www.digikey.com/product-detail/en/linear-technology-analog-devices/LT6100CMS8-TRPBF/LT6100CMS8-TRPBFCT-ND/7917234
C29-C31 = Capacitor: Dielectric: *; Percent Tolerance: *; ESR: *
R89-R94 R96-R100 R151 R152 = Resistor: Tolerance: *

## Sheet DEBUG_CONN.SchDoc
size A; SheetNumber: 16; SheetTotal: 16
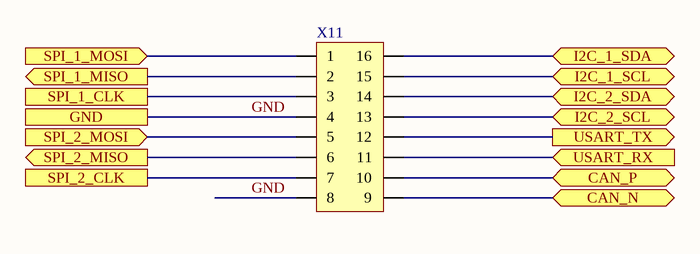
[diagram p15: DEBUG_CONN.SchDoc]

### Parts
X11  (no value)  [2x8PinHeader_0.1in]

### Ports
CAN_N (bidir), CAN_P (bidir), GND, I2C_1_SCL (bidir), I2C_1_SDA (bidir), I2C_2_SCL (bidir), I2C_2_SDA (bidir), SPI_1_CLK, SPI_1_MISO (out), SPI_1_MOSI (in), SPI_2_CLK, SPI_2_MISO (out), SPI_2_MOSI (in), USART_RX (in), USART_TX (out)

### Nets
GND: X11.4 X11.8 ; port GND  [project net DGND]
CAN_N: X11.9 ; port CAN_N
CAN_P: X11.10 ; port CAN_P
I2C_EXT_SCL: X11.15 ; port I2C_1_SCL
I2C_EXT_SDA: X11.16 ; port I2C_1_SDA
ONBOARD_I2C_SCL: X11.13 ; port I2C_2_SCL
ONBOARD_I2C_SDA: X11.14 ; port I2C_2_SDA
SPI_EXT_MISO: X11.2 ; port SPI_1_MISO
SPI_EXT_MOSI: X11.1 ; port SPI_1_MOSI
SPI_EXT_SCK: X11.3 ; port SPI_1_CLK
SPI_INT_MISO: X11.6 ; port SPI_2_MISO
SPI_INT_MOSI: X11.5 ; port SPI_2_MOSI
SPI_INT_SCK: X11.7 ; port SPI_2_CLK
USART_MCU_RX: X11.12 ; port USART_TX
USART_MCU_TX: X11.11 ; port USART_RX

### Library data of the parts
X11 = 2x8_0.1in: Generic 2x8 0.1in pitch pin header

## Nets that join several sheets
3V3_PWR: CAN (C20.2 U8.5), Temp_sense (8 pins), High_Current_Sense (5 pins), Panel_Interface (6 pins), FAN_Conn (R55.2), U_Interface_Load_Switching (10 pins), U_Low_Current_Sense (5 pins), U_Low_Current_Sense (7 pins), U_Interface_Load_Switching (10 pins)
5VSB_ATX: RTC (X5.2), ATX_Interface (5 pins), 3V3_LDO (C48.2 C49.2 C50.2 U12.3)
12V_PWR: High_Current_Sense (R83.1 R84.2), FAN_Conn (F5.1), U_Interface_Load_Switching (B3_U_Interface_Load_Switching#1.8 B4_U_Interface_Load_Switching#1.8 C42_U_Interface_Load_Switching#1.2 C43_U_Interface_Load_Switching#1.2), U_Interface_Load_Switching (B3_U_Interface_Load_Switching#2.8 B4_U_Interface_Load_Switching#2.8 C42_U_Interface_Load_Switching#2.2 C43_U_Interface_Load_Switching#2.2)
DGND: VCTS_Mainboard (R1.1), MCU (26 pins), CAN (6 pins), RTC (X5.1), Temp_sense (8 pins), High_Current_Sense (5 pins), ATX_Interface (20 pins), EEPROM (C24.1 C25.1 U9.4), U_Card_Interface (X10_U_Card_Interface#1.3 X10_U_Card_Interface#1.6 X10_U_Card_Interface#1.A2), Panel_Interface (26 pins), U_Panel_Interface/U_RGB_LED (6 pins), U_Panel_Interface/U_RGB_LED (6 pins), U_Panel_Interface/U_RGB_LED (6 pins), U_Panel_Interface/U_RGB_LED (6 pins), U_Panel_Interface/U_RGB_LED (6 pins), U_Panel_Interface/U_RGB_LED (6 pins), U_Panel_Interface/U_RGB_LED (6 pins), U_Panel_Interface/U_RGB_LED (6 pins), FAN_Conn (D11.2 D12.2 X9.1), U_Interface_Load_Switching (38 pins), 3V3_LDO (8 pins), U_Low_Current_Sense (5 pins), U_Low_Current_Sense (5 pins), U_Card_Interface (X10_U_Card_Interface#2.3 X10_U_Card_Interface#2.6 X10_U_Card_Interface#2.A2), U_Card_Interface (X10_U_Card_Interface#3.3 X10_U_Card_Interface#3.6 X10_U_Card_Interface#3.A2), U_Interface_Load_Switching (38 pins), U_Card_Interface (X10_U_Card_Interface#4.3 X10_U_Card_Interface#4.6 X10_U_Card_Interface#4.A2), DEBUG_CONN (X11.4 X11.8)
VCC: MCU (25 pins), EEPROM (6 pins), Panel_Interface (12 pins), 3V3_LDO (6 pins)
VCC_5V: CAN (C21.2 C22.2 U8.3), U_Panel_Interface/U_RGB_LED (D31_U_Panel_Interface_U_RGB_LED#1.1), U_Panel_Interface/U_RGB_LED (D31_U_Panel_Interface_U_RGB_LED#2.1), U_Panel_Interface/U_RGB_LED (D31_U_Panel_Interface_U_RGB_LED#3.1), U_Panel_Interface/U_RGB_LED (D31_U_Panel_Interface_U_RGB_LED#4.1), U_Panel_Interface/U_RGB_LED (D31_U_Panel_Interface_U_RGB_LED#5.1), U_Panel_Interface/U_RGB_LED (D31_U_Panel_Interface_U_RGB_LED#6.1), U_Panel_Interface/U_RGB_LED (D31_U_Panel_Interface_U_RGB_LED#7.1), U_Panel_Interface/U_RGB_LED (D31_U_Panel_Interface_U_RGB_LED#8.1), U_Interface_Load_Switching (B1_U_Interface_Load_Switching#1.15 C35_U_Interface_Load_Switching#1.2), U_Low_Current_Sense (R95_U_Low_Current_Sense#1.1 R96_U_Low_Current_Sense#1.2), U_Interface_Load_Switching (B1_U_Interface_Load_Switching#2.15 C35_U_Interface_Load_Switching#2.2)
3V3_ATX: ATX_Interface (F4.1 R10.2), U_Low_Current_Sense (R92_U_Low_Current_Sense#2.2 R93_U_Low_Current_Sense#2.2 R95_U_Low_Current_Sense#2.2)
3V3_ISense: MCU (U1.14), U_Interface_Load_Switching (C37_U_Interface_Load_Switching#1.2 R124_U_Interface_Load_Switching#1.1)
3V3_ISense: MCU (U1.8), U_Interface_Load_Switching (C37_U_Interface_Load_Switching#2.2 R124_U_Interface_Load_Switching#2.1)
3V3_OUT_0: U_Card_Interface (X10_U_Card_Interface#1.4 X10_U_Card_Interface#1.5), U_Interface_Load_Switching (8 pins)
3V3_OUT_0: U_Card_Interface (X10_U_Card_Interface#3.4 X10_U_Card_Interface#3.5), U_Interface_Load_Switching (8 pins)
3V3_OUT_1: U_Interface_Load_Switching (8 pins), U_Card_Interface (X10_U_Card_Interface#2.4 X10_U_Card_Interface#2.5)
3V3_OUT_1: U_Interface_Load_Switching (8 pins), U_Card_Interface (X10_U_Card_Interface#4.4 X10_U_Card_Interface#4.5)
3V3_Vsense0: VCTS_Mainboard (TP1.1), U_Interface_Load_Switching (D24_U_Interface_Load_Switching#1.2 R119_U_Interface_Load_Switching#1.1 R122_U_Interface_Load_Switching#1.2)
3V3_Vsense0: VCTS_Mainboard (TP8.1), U_Interface_Load_Switching (D24_U_Interface_Load_Switching#2.2 R119_U_Interface_Load_Switching#2.1 R122_U_Interface_Load_Switching#2.2)
3V3_Vsense1: VCTS_Mainboard (TP2.1), U_Interface_Load_Switching (D28_U_Interface_Load_Switching#1.2 R129_U_Interface_Load_Switching#1.2 R130_U_Interface_Load_Switching#1.1)
3V3_Vsense1: VCTS_Mainboard (TP9.1), U_Interface_Load_Switching (D28_U_Interface_Load_Switching#2.2 R129_U_Interface_Load_Switching#2.2 R130_U_Interface_Load_Switching#2.1)
5V_ATX: ATX_Interface (F2.1 R8.2), U_Low_Current_Sense (R92_U_Low_Current_Sense#1.2 R93_U_Low_Current_Sense#1.2 R95_U_Low_Current_Sense#1.2)
5V_ISense: MCU (U1.15), U_Interface_Load_Switching (C33_U_Interface_Load_Switching#1.2 R106_U_Interface_Load_Switching#1.1)
5V_ISense: MCU (U1.9), U_Interface_Load_Switching (C33_U_Interface_Load_Switching#2.2 R106_U_Interface_Load_Switching#2.1)
5V_OUT_0: U_Card_Interface (X10_U_Card_Interface#1.1 X10_U_Card_Interface#1.2), U_Interface_Load_Switching (8 pins)
5V_OUT_0: U_Card_Interface (X10_U_Card_Interface#3.1 X10_U_Card_Interface#3.2), U_Interface_Load_Switching (8 pins)
5V_OUT_1: U_Interface_Load_Switching (8 pins), U_Card_Interface (X10_U_Card_Interface#2.1 X10_U_Card_Interface#2.2)
5V_OUT_1: U_Interface_Load_Switching (8 pins), U_Card_Interface (X10_U_Card_Interface#4.1 X10_U_Card_Interface#4.2)
5V_Vsense0: VCTS_Mainboard (TP3.1), U_Interface_Load_Switching (D13_U_Interface_Load_Switching#1.2 R101_U_Interface_Load_Switching#1.1 R104_U_Interface_Load_Switching#1.2)
5V_Vsense0: VCTS_Mainboard (TP10.1), U_Interface_Load_Switching (D13_U_Interface_Load_Switching#2.2 R101_U_Interface_Load_Switching#2.1 R104_U_Interface_Load_Switching#2.2)
5V_Vsense1: VCTS_Mainboard (TP4.1), U_Interface_Load_Switching (D17_U_Interface_Load_Switching#1.2 R111_U_Interface_Load_Switching#1.2 R112_U_Interface_Load_Switching#1.1)
5V_Vsense1: VCTS_Mainboard (TP11.1), U_Interface_Load_Switching (D17_U_Interface_Load_Switching#2.2 R111_U_Interface_Load_Switching#2.2 R112_U_Interface_Load_Switching#2.1)
12V_ATX: High_Current_Sense (R80.2 R81.2 R83.2), ATX_Interface (F1.1 R7.2)
12V_IN_1: MCU (U1.24), U_Interface_Load_Switching (R103_U_Interface_Load_Switching#1.2 R121_U_Interface_Load_Switching#1.2 R131_U_Interface_Load_Switching#1.1)
12V_IN_1: MCU (U1.37), U_Interface_Load_Switching (R103_U_Interface_Load_Switching#2.2 R121_U_Interface_Load_Switching#2.2 R131_U_Interface_Load_Switching#2.1)
12V_IN_2: MCU (U1.25), U_Interface_Load_Switching (R110_U_Interface_Load_Switching#1.2 R128_U_Interface_Load_Switching#1.2 R132_U_Interface_Load_Switching#1.1)
12V_IN_2: MCU (U1.38), U_Interface_Load_Switching (R110_U_Interface_Load_Switching#2.2 R128_U_Interface_Load_Switching#2.2 R132_U_Interface_Load_Switching#2.1)
12V_ISense_1: MCU (U1.16), U_Interface_Load_Switching (C44_U_Interface_Load_Switching#1.2 D29_U_Interface_Load_Switching#1.2 R133_U_Interface_Load_Switching#1.1)
12V_ISense_1: MCU (U1.10), U_Interface_Load_Switching (C44_U_Interface_Load_Switching#2.2 D29_U_Interface_Load_Switching#2.2 R133_U_Interface_Load_Switching#2.1)
12V_ISense_2: MCU (U1.17), U_Interface_Load_Switching (C45_U_Interface_Load_Switching#1.2 D30_U_Interface_Load_Switching#1.2 R134_U_Interface_Load_Switching#1.1)
12V_ISense_2: MCU (U1.11), U_Interface_Load_Switching (C45_U_Interface_Load_Switching#2.2 D30_U_Interface_Load_Switching#2.2 R134_U_Interface_Load_Switching#2.1)
12V_OUT_1: U_Card_Interface (X10_U_Card_Interface#1.A1), U_Interface_Load_Switching (6 pins)
12V_OUT_1: U_Card_Interface (X10_U_Card_Interface#3.A1), U_Interface_Load_Switching (6 pins)
12V_OUT_2: U_Interface_Load_Switching (6 pins), U_Card_Interface (X10_U_Card_Interface#2.A1)
12V_OUT_2: U_Interface_Load_Switching (6 pins), U_Card_Interface (X10_U_Card_Interface#4.A1)
ADC1_IN10: MCU (U1.22), Temp_sense (TP19.1 U2.2)
ADC1_IN11: MCU (U1.26), Temp_sense (TP21.1 U4.2)
ADC1_IN14: MCU (U1.30), Temp_sense (TP20.1 U3.2)
ADC1_IN15: MCU (U1.23), Temp_sense (TP22.1 U5.2)
AGND: VCTS_Mainboard (R1.2), MCU (C4.1 C5.1 U1.12)
CAN_N: CAN (R58.2 TP33.1 U8.6), U_Card_Interface (R70_U_Card_Interface#1.1), U_Card_Interface (R70_U_Card_Interface#2.1), U_Card_Interface (R70_U_Card_Interface#3.1), U_Card_Interface (R70_U_Card_Interface#4.1), DEBUG_CONN (X11.9)
CAN_P: CAN (R62.1 TP34.1 U8.7), U_Card_Interface (R71_U_Card_Interface#1.1), U_Card_Interface (R71_U_Card_Interface#2.1), U_Card_Interface (R71_U_Card_Interface#3.1), U_Card_Interface (R71_U_Card_Interface#4.1), DEBUG_CONN (X11.10)
CAN_RX: MCU (U1.61), CAN (R60.1)
CAN_TX: MCU (U1.62), CAN (R59.1)
EEPROM_CS: MCU (U1.20), EEPROM (R74.1 U9.1)
EEPROM_HOLD: VCTS_Mainboard (TP5.1), EEPROM (R73.1 U9.7)
EEPROM_WP: VCTS_Mainboard (TP6.1), EEPROM (R72.1 U9.3)
FAN_PWM: MCU (U1.41), FAN_Conn (D12.1 R57.2)
FAN_TACH: VCTS_Mainboard (TP7.1), FAN_Conn (D11.1 R55.1 R56.2)
I2C_EXT_SCL: MCU (U1.58), U_Card_Interface (R69_U_Card_Interface#1.1), U_Card_Interface (R69_U_Card_Interface#2.1), U_Card_Interface (R69_U_Card_Interface#3.1), U_Card_Interface (R69_U_Card_Interface#4.1), DEBUG_CONN (X11.15)
I2C_EXT_SDA: MCU (U1.59), U_Card_Interface (R68_U_Card_Interface#1.1), U_Card_Interface (R68_U_Card_Interface#2.1), U_Card_Interface (R68_U_Card_Interface#3.1), U_Card_Interface (R68_U_Card_Interface#4.1), DEBUG_CONN (X11.16)
LED_CTL_BRD1_B: Panel_Interface (U6.4), U_Panel_Interface/U_RGB_LED (R142_U_Panel_Interface_U_RGB_LED#4.1 R143_U_Panel_Interface_U_RGB_LED#4.2)
LED_CTL_BRD1_G: Panel_Interface (U6.5), U_Panel_Interface/U_RGB_LED (R144_U_Panel_Interface_U_RGB_LED#4.1 R145_U_Panel_Interface_U_RGB_LED#4.2)
LED_CTL_BRD1_R: Panel_Interface (U6.6), U_Panel_Interface/U_RGB_LED (R146_U_Panel_Interface_U_RGB_LED#4.1 R147_U_Panel_Interface_U_RGB_LED#4.2)
LED_CTL_BRD2_B: Panel_Interface (U6.7), U_Panel_Interface/U_RGB_LED (R142_U_Panel_Interface_U_RGB_LED#3.1 R143_U_Panel_Interface_U_RGB_LED#3.2)
LED_CTL_BRD2_G: Panel_Interface (U6.8), U_Panel_Interface/U_RGB_LED (R144_U_Panel_Interface_U_RGB_LED#3.1 R145_U_Panel_Interface_U_RGB_LED#3.2)
LED_CTL_BRD2_R: Panel_Interface (U6.9), U_Panel_Interface/U_RGB_LED (R146_U_Panel_Interface_U_RGB_LED#3.1 R147_U_Panel_Interface_U_RGB_LED#3.2)
LED_CTL_BRD3_B: Panel_Interface (U6.10), U_Panel_Interface/U_RGB_LED (R142_U_Panel_Interface_U_RGB_LED#2.1 R143_U_Panel_Interface_U_RGB_LED#2.2)
LED_CTL_BRD3_G: Panel_Interface (U6.11), U_Panel_Interface/U_RGB_LED (R144_U_Panel_Interface_U_RGB_LED#2.1 R145_U_Panel_Interface_U_RGB_LED#2.2)
LED_CTL_BRD3_R: Panel_Interface (U6.13), U_Panel_Interface/U_RGB_LED (R146_U_Panel_Interface_U_RGB_LED#2.1 R147_U_Panel_Interface_U_RGB_LED#2.2)
LED_CTL_BRD4_B: Panel_Interface (U6.14), U_Panel_Interface/U_RGB_LED (R142_U_Panel_Interface_U_RGB_LED#1.1 R143_U_Panel_Interface_U_RGB_LED#1.2)
LED_CTL_BRD4_G: Panel_Interface (U6.15), U_Panel_Interface/U_RGB_LED (R144_U_Panel_Interface_U_RGB_LED#1.1 R145_U_Panel_Interface_U_RGB_LED#1.2)
LED_CTL_BRD4_R: Panel_Interface (U6.16), U_Panel_Interface/U_RGB_LED (R146_U_Panel_Interface_U_RGB_LED#1.1 R147_U_Panel_Interface_U_RGB_LED#1.2)
LED_CTL_PWR_B: Panel_Interface (U7.13), U_Panel_Interface/U_RGB_LED (R142_U_Panel_Interface_U_RGB_LED#5.1 R143_U_Panel_Interface_U_RGB_LED#5.2)
LED_CTL_PWR_G: Panel_Interface (U7.5), U_Panel_Interface/U_RGB_LED (R144_U_Panel_Interface_U_RGB_LED#5.1 R145_U_Panel_Interface_U_RGB_LED#5.2)
LED_CTL_PWR_R: Panel_Interface (U7.4), U_Panel_Interface/U_RGB_LED (R146_U_Panel_Interface_U_RGB_LED#5.1 R147_U_Panel_Interface_U_RGB_LED#5.2)
LED_CTL_SPARE_B: Panel_Interface (U7.14), U_Panel_Interface/U_RGB_LED (R142_U_Panel_Interface_U_RGB_LED#8.1 R143_U_Panel_Interface_U_RGB_LED#8.2)
LED_CTL_SPARE_G: Panel_Interface (U7.15), U_Panel_Interface/U_RGB_LED (R144_U_Panel_Interface_U_RGB_LED#8.1 R145_U_Panel_Interface_U_RGB_LED#8.2)
LED_CTL_SPARE_R: Panel_Interface (U7.16), U_Panel_Interface/U_RGB_LED (R146_U_Panel_Interface_U_RGB_LED#8.1 R147_U_Panel_Interface_U_RGB_LED#8.2)
LED_CTL_STATUS_B: Panel_Interface (U7.9), U_Panel_Interface/U_RGB_LED (R142_U_Panel_Interface_U_RGB_LED#6.1 R143_U_Panel_Interface_U_RGB_LED#6.2)
LED_CTL_STATUS_G: Panel_Interface (U7.10), U_Panel_Interface/U_RGB_LED (R144_U_Panel_Interface_U_RGB_LED#6.1 R145_U_Panel_Interface_U_RGB_LED#6.2)
LED_CTL_STATUS_R: Panel_Interface (U7.11), U_Panel_Interface/U_RGB_LED (R146_U_Panel_Interface_U_RGB_LED#6.1 R147_U_Panel_Interface_U_RGB_LED#6.2)
LED_CTL_USER_B: Panel_Interface (U7.6), U_Panel_Interface/U_RGB_LED (R142_U_Panel_Interface_U_RGB_LED#7.1 R143_U_Panel_Interface_U_RGB_LED#7.2)
LED_CTL_USER_G: Panel_Interface (U7.7), U_Panel_Interface/U_RGB_LED (R144_U_Panel_Interface_U_RGB_LED#7.1 R145_U_Panel_Interface_U_RGB_LED#7.2)
LED_CTL_USER_R: Panel_Interface (U7.8), U_Panel_Interface/U_RGB_LED (R146_U_Panel_Interface_U_RGB_LED#7.1 R147_U_Panel_Interface_U_RGB_LED#7.2)
ONBOARD_I2C_SCL: MCU (U1.6), RTC (R25.1), High_Current_Sense (R150.1), Panel_Interface (R28.1 R29.1), U_Low_Current_Sense (R152_U_Low_Current_Sense#1.1), U_Low_Current_Sense (R152_U_Low_Current_Sense#2.1), DEBUG_CONN (X11.13)
ONBOARD_I2C_SDA: MCU (U1.5), RTC (R26.1), High_Current_Sense (R149.1), Panel_Interface (R30.1 R31.1), U_Low_Current_Sense (R151_U_Low_Current_Sense#1.1), U_Low_Current_Sense (R151_U_Low_Current_Sense#2.1), DEBUG_CONN (X11.14)
~{PS_ON}: MCU (U1.54), ATX_Interface (R3.1 R6.1 R11.2 TP17.1)
PWR_D_EN: MCU (U1.39), U_Interface_Load_Switching (R105_U_Interface_Load_Switching#1.2 R123_U_Interface_Load_Switching#1.2), U_Interface_Load_Switching (R105_U_Interface_Load_Switching#2.2 R123_U_Interface_Load_Switching#2.2)
PWR_D_SEL: MCU (U1.40), U_Interface_Load_Switching (R108_U_Interface_Load_Switching#1.1 R126_U_Interface_Load_Switching#1.1), U_Interface_Load_Switching (R108_U_Interface_Load_Switching#2.1 R126_U_Interface_Load_Switching#2.1)
PWR_OK_ATX: MCU (U1.2), ATX_Interface (5 pins)
~{RST}: MCU (R16.1 R24.1 R154.2 X4.15), Panel_Interface (R42.1 S6.1)
SPI_CS_BRD1_1: MCU (U1.21), U_Card_Interface (R65_U_Card_Interface#1.2)
SPI_CS_BRD1_2: MCU (U1.27), U_Card_Interface (R64_U_Card_Interface#1.1)
SPI_CS_BRD2_1: MCU (U1.28), U_Card_Interface (R65_U_Card_Interface#2.2)
SPI_CS_BRD2_2: MCU (U1.57), U_Card_Interface (R64_U_Card_Interface#2.1)
SPI_CS_BRD3_1: MCU (U1.29), U_Card_Interface (R65_U_Card_Interface#3.2)
SPI_CS_BRD3_2: MCU (U1.33), U_Card_Interface (R64_U_Card_Interface#3.1)
SPI_CS_BRD4_1: MCU (U1.4), U_Card_Interface (R65_U_Card_Interface#4.2)
SPI_CS_BRD4_2: MCU (U1.3), U_Card_Interface (R64_U_Card_Interface#4.1)
SPI_EXT_MISO: MCU (U1.35), U_Card_Interface (R153_U_Card_Interface#1.1), U_Card_Interface (R153_U_Card_Interface#2.1), U_Card_Interface (R153_U_Card_Interface#3.1), U_Card_Interface (R153_U_Card_Interface#4.1), DEBUG_CONN (X11.2)
SPI_EXT_MOSI: MCU (U1.34), U_Card_Interface (R67_U_Card_Interface#1.1), U_Card_Interface (R67_U_Card_Interface#2.1), U_Card_Interface (R67_U_Card_Interface#3.1), U_Card_Interface (R67_U_Card_Interface#4.1), DEBUG_CONN (X11.1)
SPI_EXT_SCK: MCU (U1.36), U_Card_Interface (R66_U_Card_Interface#1.1), U_Card_Interface (R66_U_Card_Interface#2.1), U_Card_Interface (R66_U_Card_Interface#3.1), U_Card_Interface (R66_U_Card_Interface#4.1), DEBUG_CONN (X11.3)
SPI_INT_MISO: MCU (U1.52), EEPROM (R76.2), DEBUG_CONN (X11.6)
SPI_INT_MOSI: MCU (U1.53), EEPROM (R75.2), DEBUG_CONN (X11.5)
SPI_INT_SCK: MCU (U1.51), EEPROM (U9.6), DEBUG_CONN (X11.7)
STBY: VCTS_Mainboard (TP12.1), CAN (R61.1)
USART_MCU_RX: MCU (U1.43), DEBUG_CONN (X11.12)
USART_MCU_TX: MCU (U1.42), DEBUG_CONN (X11.11)
USB_D_N: MCU (U1.44), Panel_Interface (D9.1 R52.1)
USB_D_P: MCU (U1.45), Panel_Interface (D9.2 R51.1)

## Assembly variants
Debug: not fitted R18 R37 R38 R39 R45 R46 R47 R88 R89 R92 R96 R97 R98 R114 R115 R117 R118 R119 R127